# Altium schematic sheet Consola_ESP32_V2.SchDoc
size A4; SheetNumber: 4; SheetTotal: 4
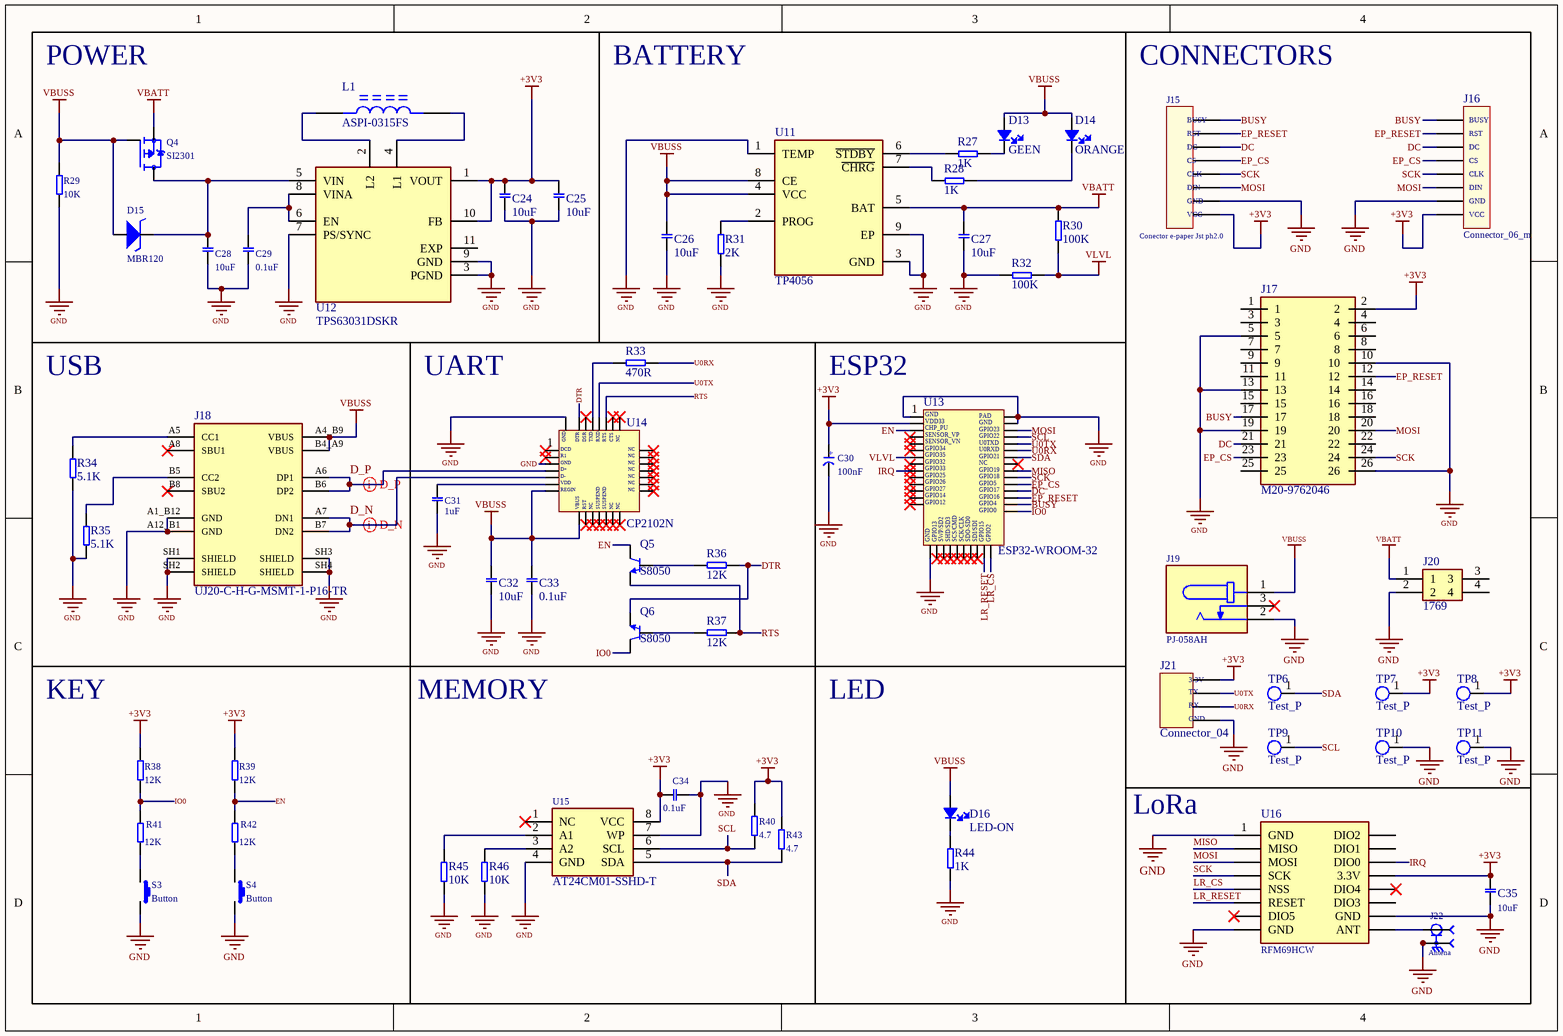
[diagram p0: Consola_ESP32_V2.SchDoc]

## Parts
C24  10uF  [CAPCP1608_0603]
C25  10uF  [CAPCP1608_0603]
C26  10uF  [CAPCP1608_0603]
C27  10uF  [CAPCP1608_0603]
C28  10uF  [CAPCP1608_0603]
C29  0.1uF  [CAPCP1608_0603]
C30  100nF  [CAPC_1206]
C31  1uF  [CAPCP1608_0603]
C32  10uF  [CAPCP1608_0603]
C33  0.1uF  [CAPCP1608_0603]
C34  0.1uF  [CAPCP1608_0603]
C35  10uF  [CAPCP1608_0603]
D13  GEEN  [DIODO_0603]
D14  ORANGE  [DIODO_0603]
D15  MBR120  [SODFL3616X98N]
D16  LED-ON  [DIODO_0603]
J15  Conector e-paper Jst ph2.0  [CONN_S8B-PH-SM4-TB_JST]
J16  Connector_06_m  [HDR1X8]
J17  M20-9762046  [HARWIN_M20-9762046]
J18  UJ20-C-H-G-MSMT-1-P16-TR  [uJ20-C-H-G-MSMT-1-P16-TR]
J19  PJ-058AH  [CUI_PJ-058AH]
J20  1769  [1769_Conector_Bateria]
J21  Connector_04  [HDR1X4]
J22  Antena  [SAMTEC_RSP-122811-01]
L1  ASPI-0315FS  [IND_ASPI-0315FS-1R0N-T2]
Q4  SI2301  [SOT-23]
Q5  S8050  [SOT23_8050_JY3]
Q6  S8050  [SOT23_8050_JY3]
R27  1K  [RESC1608_0603]
R28  1K  [RESC1608_0603]
R29  10K  [RESC1608_0603]
R30  100K  [RESC1608_0603]
R31  2K  [RESC1608_0603]
R32  100K  [RESC1608_0603]
R33  470R  [RESC1608_0603]
R34  5.1K  [RESC1608_0603]
R35  5.1K  [RESC1608_0603]
R36  12K  [RESC1608_0603]
R37  12K  [RESC1608_0603]
R38  12K  [RESC1608_0603]
R39  12K  [RESC1608_0603]
R40  4.7  [RESC1608_0603]
R41  12K  [RESC1608_0603]
R42  12K  [RESC1608_0603]
R43  4.7  [RESC1608_0603]
R44  1K  [RESC1608_0603]
R45  10K  [RESC1608_0603]
R46  10K  [RESC1608_0603]
S3  Button  [Button_3_4_2]
S4  Button  [Button_3_4_2]
TP6  Test_P  [Test_point]
TP7  Test_P  [Test_point]
TP8  Test_P  [Test_point]
TP9  Test_P  [Test_point]
TP10  Test_P  [Test_point]
TP11  Test_P  [Test_point]
U11  TP4056  [SOP127P600X175-9N]
U12  TPS63031DSKR  [SON50P250X250X80-11N]
U13  ESP32-WROOM-32  [ESP32]
U14  CP2102N  [QFN_CP2102]
U15  AT24CM01-SSHD-T  [SOIC-8N]
U16  RFM69HCW  [COM-13909]

## Nets
+3V3: C24.2 C25.2 C30.2 C34.1 C35.2 J15.8 J16.8 J17.2 J21.1 R38.2 R39.2 R40.2 R43.1 TP7.1 TP8.1 U12.1(VOUT) U12.10(FB) U13.2 U15.8(VCC) U16.13(3.3V)
GND: C24.1 C25.1 C26.1 C27.1 C28.1 C29.1 C30.1 C31.2 C32.1 C33.1 C34.2 C35.1 J15.7 J16.7 J17.5 J17.10 J17.13 J17.19 J17.26 J18.A1_B12(GND) J18.A12_B1(GND) J18.SH1(SHIELD) J18.SH2(SHIELD) J18.SH3(SHIELD) J18.SH4(SHIELD) J19.2 J20.2 J21.4 J22.G1(GND) J22.G2(GND) R29.1 R31.2 R32.2 R34.1 R35.1 R44.1 R45.1 R46.1 S3.2 S4.2 TP10.1 TP11.1 U11.1(TEMP) U11.3(GND) U11.9(EP) U12.3(PGND) U12.7(PS/SYNC) U12.9(GND) U13.1 U13.15 U13.38 U13.39 U14.3 U14.29 U15.4(GND) U15.7(WP) U16.1(GND) U16.8(GND) U16.10(GND)
VBATT: C27.2 J20.1 Q4.2(S) R30.2 U11.5(BAT)
VBUSS: C26.2 C32.2 C33.2 D13.1 D14.1 D15.1 D16.1 J18.A4_B9(VBUS) J18.B4_A9(VBUS) J19.1 Q4.1(G) R29.2 U11.4(VCC) U11.8(CE) U14.7 U14.8
VLVL: R30.1 R32.1 U13.7
BUSY: J15.1 J16.1 J17.17 U13.26
D_N: J18.A7(DN1) J18.B7(DN2) U14.5
D_P: J18.A6(DP1) J18.B6(DP2) U14.4
DC: J15.3 J16.3 J17.21 U13.28
DTR: Q6.3 R36.2 U14.28
EN: Q5.1 R39.1 R42.2 U13.3
EP_CS: J15.4 J16.4 J17.23 U13.29
EP_RESET: J15.2 J16.2 J17.12 U13.27
IO0: Q6.1 R38.1 R41.2 U13.25
IRQ: U13.9 U16.14(DIO0)
LR_CS: U13.24 U16.5(NSS)
LR_RESET: U13.23 U16.6(RESET)
MISO: U13.31 U16.2(MISO)
MOSI: J15.6 J16.6 J17.20 U13.37 U16.3(MOSI)
RTS: Q5.3 R37.2 U14.24
SCK: J15.5 J16.5 J17.24 U13.30 U16.4(SCK)
SCL: R40.1 TP9.1 U13.36 U15.6(SCL)
SDA: R43.2 TP6.1 U13.33 U15.5(SDA)
U0RX: J21.3 R33.2 U13.34
U0TX: J21.2 U13.35 U14.25
NetC28_2: C28.2 D15.2 Q4.3(D) U12.5(VIN)
NetC29_2: C29.2 U12.6(EN) U12.8(VINA)
NetC31_1: C31.1 U14.6
NetD13_2: D13.2 R27.1
NetD14_2: D14.2 R28.1
NetD16_2: D16.2 R44.2
NetJ18_A5: J18.A5(CC1) R34.2
NetJ18_B5: J18.B5(CC2) R35.2
NetJ22_1: J22.1 U16.9(ANT)
NetL1_1: L1.1 U12.2(L2)
NetL1_2: L1.2 U12.4(L1)
NetQ5_2: Q5.2 R36.1
NetQ6_2: Q6.2 R37.1
NetR27_2: R27.2 U11.6(~{STDBY})
NetR28_2: R28.2 U11.7(~{CHRG})
NetR31_1: R31.1 U11.2(PROG)
NetR33_1: R33.1 U14.26
NetR41_1: R41.1 S3.1
NetR42_1: R42.1 S4.1
NetR45_2: R45.2 U15.2(A1)
NetR46_2: R46.2 U15.3(A2)

Not connected (* = marked no-connect by the designer): J17 1 3 4 6 7 8 9 11 14 15 16 18 22 25; J18 A8(SBU1)* B8(SBU2)*; J19 3*; J20 3 4; U12 11(EXP); U13 4* 5* 6* 8* 10* 11* 12* 13* 14* 16* 17* 18* 19* 20* 21* 22* 32*; U14 1* 2* 9* 10* 11* 12* 13* 14* 15* 16* 17* 18* 19* 20* 21* 22* 23* 27*; U15 1(NC)*; U16 7(DIO5)* 11(DIO3) 12(DIO4)* 15(DIO1) 16(DIO2)

## Layout directives
differential pair: D_N, D_P

## Notes on the sheet
- POWER
- BATTERY
- (near J15) CONNECTORS
- USB
- UART
- (near U13) ESP32
- KEY
- MEMORY
- LED
- LoRa
- (in symbol Connector_04_uart) 3.3V; TX; RX; GND
- (in symbol Connector_08_m) BUSY; RST; DC; CS; CLK; DIN; GND; VCC
- (in symbol CP2102N-A02-GQFN28R) GND; DTR; DSR; TXD; RXD; RTS; CTS; NC; DCD; R1; D+; D-; VDD; REGIN; VBUS; RST; SUSPEND
- (in symbol ESP32-WROOM-32) GND; VDD33; PAD; CHP_PU; SENSOR_VP; GPIO23; SENSOR_VN; GPIO22; GPIO34; U0TXD; GPIO35; U0RXD; GPIO32; GPIO21; GPIO33; NC; GPIO25; GPIO19; GPIO26; GPIO18; GPIO27; GPIO5; GPIO14; GPIO17; GPIO12; GPIO16; GPIO4; GPIO0; GPIO13; SWP/SD2; SHD/SD3; SCS/CMD; SCK/CLK; SDO-SD0; SDI/SDI; GPIO15; GPIO2
- (in symbol S8B-PH-SM4-TBLFSN) BUSY; RST; DC; CS; CLK; DIN; GND; VCC
- (in symbol TAJD107K016RNJ) +

## Library data of the parts
C24-C28 C32 C35 = C0603X100J1GACAUTO: Capacitor_10uF_0603
C29 C33 C34 = 06035C104K4T4A: Capacitor_0.1uF_0603
C30 = TAJD107K016RNJ: Capacitor_100uF_1206
C31 = C0603X105J4RACTU: Capacitor_1uF_0603
D13 D16 = SMLD12EN1WT86: LED_VERDE_0603
D14 = SML-D12D1WT86: LED_NARANJA_0603
D15 = MBR120ESFT3G: Diodo_Zenner_Sod-123FL-2
J15 = S8B-PH-SM4-TBLFSN: Connector e-paper; Mfr_Name: JST; RefDes: RefDes; Type: Type
J16 = Connector_08_m
J17 = M20-9762046: 2X20 - 2.54mm; Package: None; Price: None; Value: *; MP: M20-9762046; Availability: Unavailable
J18 = UJ20-C-H-G-MSMT-1-P16-TR: Conector usb c; Package: None; Price: None; Value: *; MP: UJ20-C-H-G-MSMT-1-P16-TR; Availability: Unavailable
J19 = PJ-058AH: 2.0 x 5.7 mm, 5.0 A, Horizontal, Through Hole, Locking Type, Dc Power Jack Connector; MF: CUI Devices; SnapEDA_Link: https://www.snapeda.com/parts/PJ-058AH/CUI+Devices/view-part/?ref=snap; Package: None; Value: *; CUI_purchase_URL: https://www.cuidevices.com/product/interconnect/connectors/dc-power-connectors/jacks/pj-058ah?utm_source=snapeda.com&utm_medium=referral&utm_campaign=snapedaBOM; MP: PJ-058AH; Check_prices: https://www.snapeda.com/parts/PJ-058AH/CUI+Devices/view-part/?ref=eda
J20 = 1769: Adafruit Accessories JST-PH 2-pin SMT Right Angle Connect; Geometry.Height: 5.5mm; Mouser Part Number: 485-1769; Mouser Price/Stock: https://www.mouser.co.uk/ProductDetail/Adafruit/1769?qs=GURawfaeGuBbgoGtf2XstA%3D%3D; Manufacturer_Name: Adafruit; Manufacturer_Part_Number: 1769; Datasheet Link: https://cdn-shop.adafruit.com/datasheets/17311.pdf
J21 = Connector_04_uart
J22 = RSP-122811-01: U.FL (UMCC), IPEX MHF1 Connector Receptacle, Male Pin 50Ohm Surface Mount Solder; Availability: Unavailable; MP: RSP-122811-01; Value: *; Price: None; Package: None
L1 = ASPI-0315FS-1R0N-T2: Package: None; Price: None; Value: *; MP: ASPI-0315FS-1R0N-T2; Availability: Unavailable
Q4 = SI2301CDS-T1-GE3: P-Channel 20 V 3.1A (Tc) 860mW (Ta), 1.6W (Tc) Surface Mount SOT-23; MF: Vishay; Package: SOT-23-3 Vishay Siliconix; Price: None; Check_prices: https://www.snapeda.com/parts/SI2301CDS-T1-GE3/Vishay+Siliconix/view-part/?ref=eda; Value: *; SnapEDA_Link: https://www.snapeda.com/parts/SI2301CDS-T1-GE3/Vishay+Siliconix/view-part/?ref=snap; MP: SI2301CDS-T1-GE3; Availability: In Stock; Purchase-URL: https://pricing.snapeda.com/search?q=SI2301CDS-T1-GE3&ref=eda
Q5 Q6 = ASS8050-L-HF: Transistor_Sot_23_j3y
R27 R28 R44 = RCA06031K00JNEA: Resistencia_1K_0603
R29 R45 R46 = RCA060310K0JNEA: Resistencia_10K_0603
R30 R32 = RCA0603100KFKEAHP: Resistencia_100K_0603
R31 = RCA06032K00FKEA: Resistencia_2K_0603
R33 = RCA0603470RFKEA: Resistencia_470R_0603
R34 R35 = RCA06035K10JNEA: Resistencia_5.1K_0603
R36-R39 = RCA060312K0JNEA: Resistencia_12KR_0603
R40 R43 = RCA06034K70FKEA: Resistencia_4.7K_0603
R41 R42 = 12KR_0603_25w
S3 S4 = Button: Tactile Switch
TP6-TP11 = Test_point
U11 = TP4056: Linear Li-Ion charger IC, 4.2V CC/CV, up to 1A, auto-recharge, thermal regulation.; MF: NanJing Top Power ASIC Corp.; Check_prices: https://www.snapeda.com/parts/TP4056/NanJing+Top+Power+ASIC+Corp./view-part/?ref=eda; SnapEDA_Link: https://www.snapeda.com/parts/TP4056/NanJing+Top+Power+ASIC+Corp./view-part/?ref=snap; Price: None; Availability: Not in stock; Package: Package; MP: TP4056; Value: *
U12 = TPS63031DSKR: High Efficient Single Inductor Buck-Boost Converter with 1-A Switches; MP: TPS63031DSKR; Availability: Unavailable; Value: *; Package: None; Price: None
U13 = ESP32-WROOM-32: ESP-32_48Pines
U14 = CP2102N-A02-GQFN28R: Conversor USB a UART de Silicon Labs CP2102
U15 = AT24CM01-SSHD-T: EEPROM SERIAL EEPROM, 1M 2-WIR-8 SOIC; Manufacturer_Name: Microchip; Geometry.Height: 1.75mm; Mouser Part Number: 556-AT24CM01-SSHD-T; Mouser Price/Stock: https://www.mouser.co.uk/ProductDetail/Microchip-Technology/AT24CM01-SSHD-T?qs=s44pgLhgXQig9Z6HBeFbBg%3D%3D; Manufacturer_Part_Number: AT24CM01-SSHD-T; Datasheet Link: https://4donline.ihs.com/images/VipMasterIC/IC/ATML/ATML-S-A0000726505/ATML-S-A0000726505-1.pdf?hkey=EF798316E3902B6ED9A73243A3159BB0
U16 = COM-13909: Rfm69hcw Wireless Transceiver 91; Value: *; MP: COM-13909; Package: None; Availability: Unavailable; Price: None